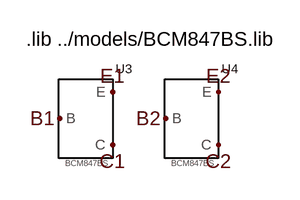
[diagram p0: schematic BCM847BS_pair.asc]
BCM847BS_pair.asc, the LTspice schematic file:
Version 4.1
SHEET 1 880 680
FLAG 160 128 B1
FLAG 288 128 B2
FLAG 224 96 E1
FLAG 352 96 E2
FLAG 224 160 C1
FLAG 352 160 C2
SYMBOL BCM847BS 320 160 R0
SYMATTR InstName U3
SYMBOL BCM847BS 448 160 R0
SYMATTR InstName U4
TEXT 120 32 Left 2 !.lib ../models/BCM847BS.lib

The netlist it stands for:
* BCM847BS_pair.asc
X§U3 E1 B1 C1 BCM847BS  ; pins E B C
X§U4 E2 B2 C2 BCM847BS  ; pins E B C
.lib ../models/BCM847BS.lib
.backanno
.end